# EAGLE schematic DLT_Jetson_Nano (EAGLE 9.4.2)
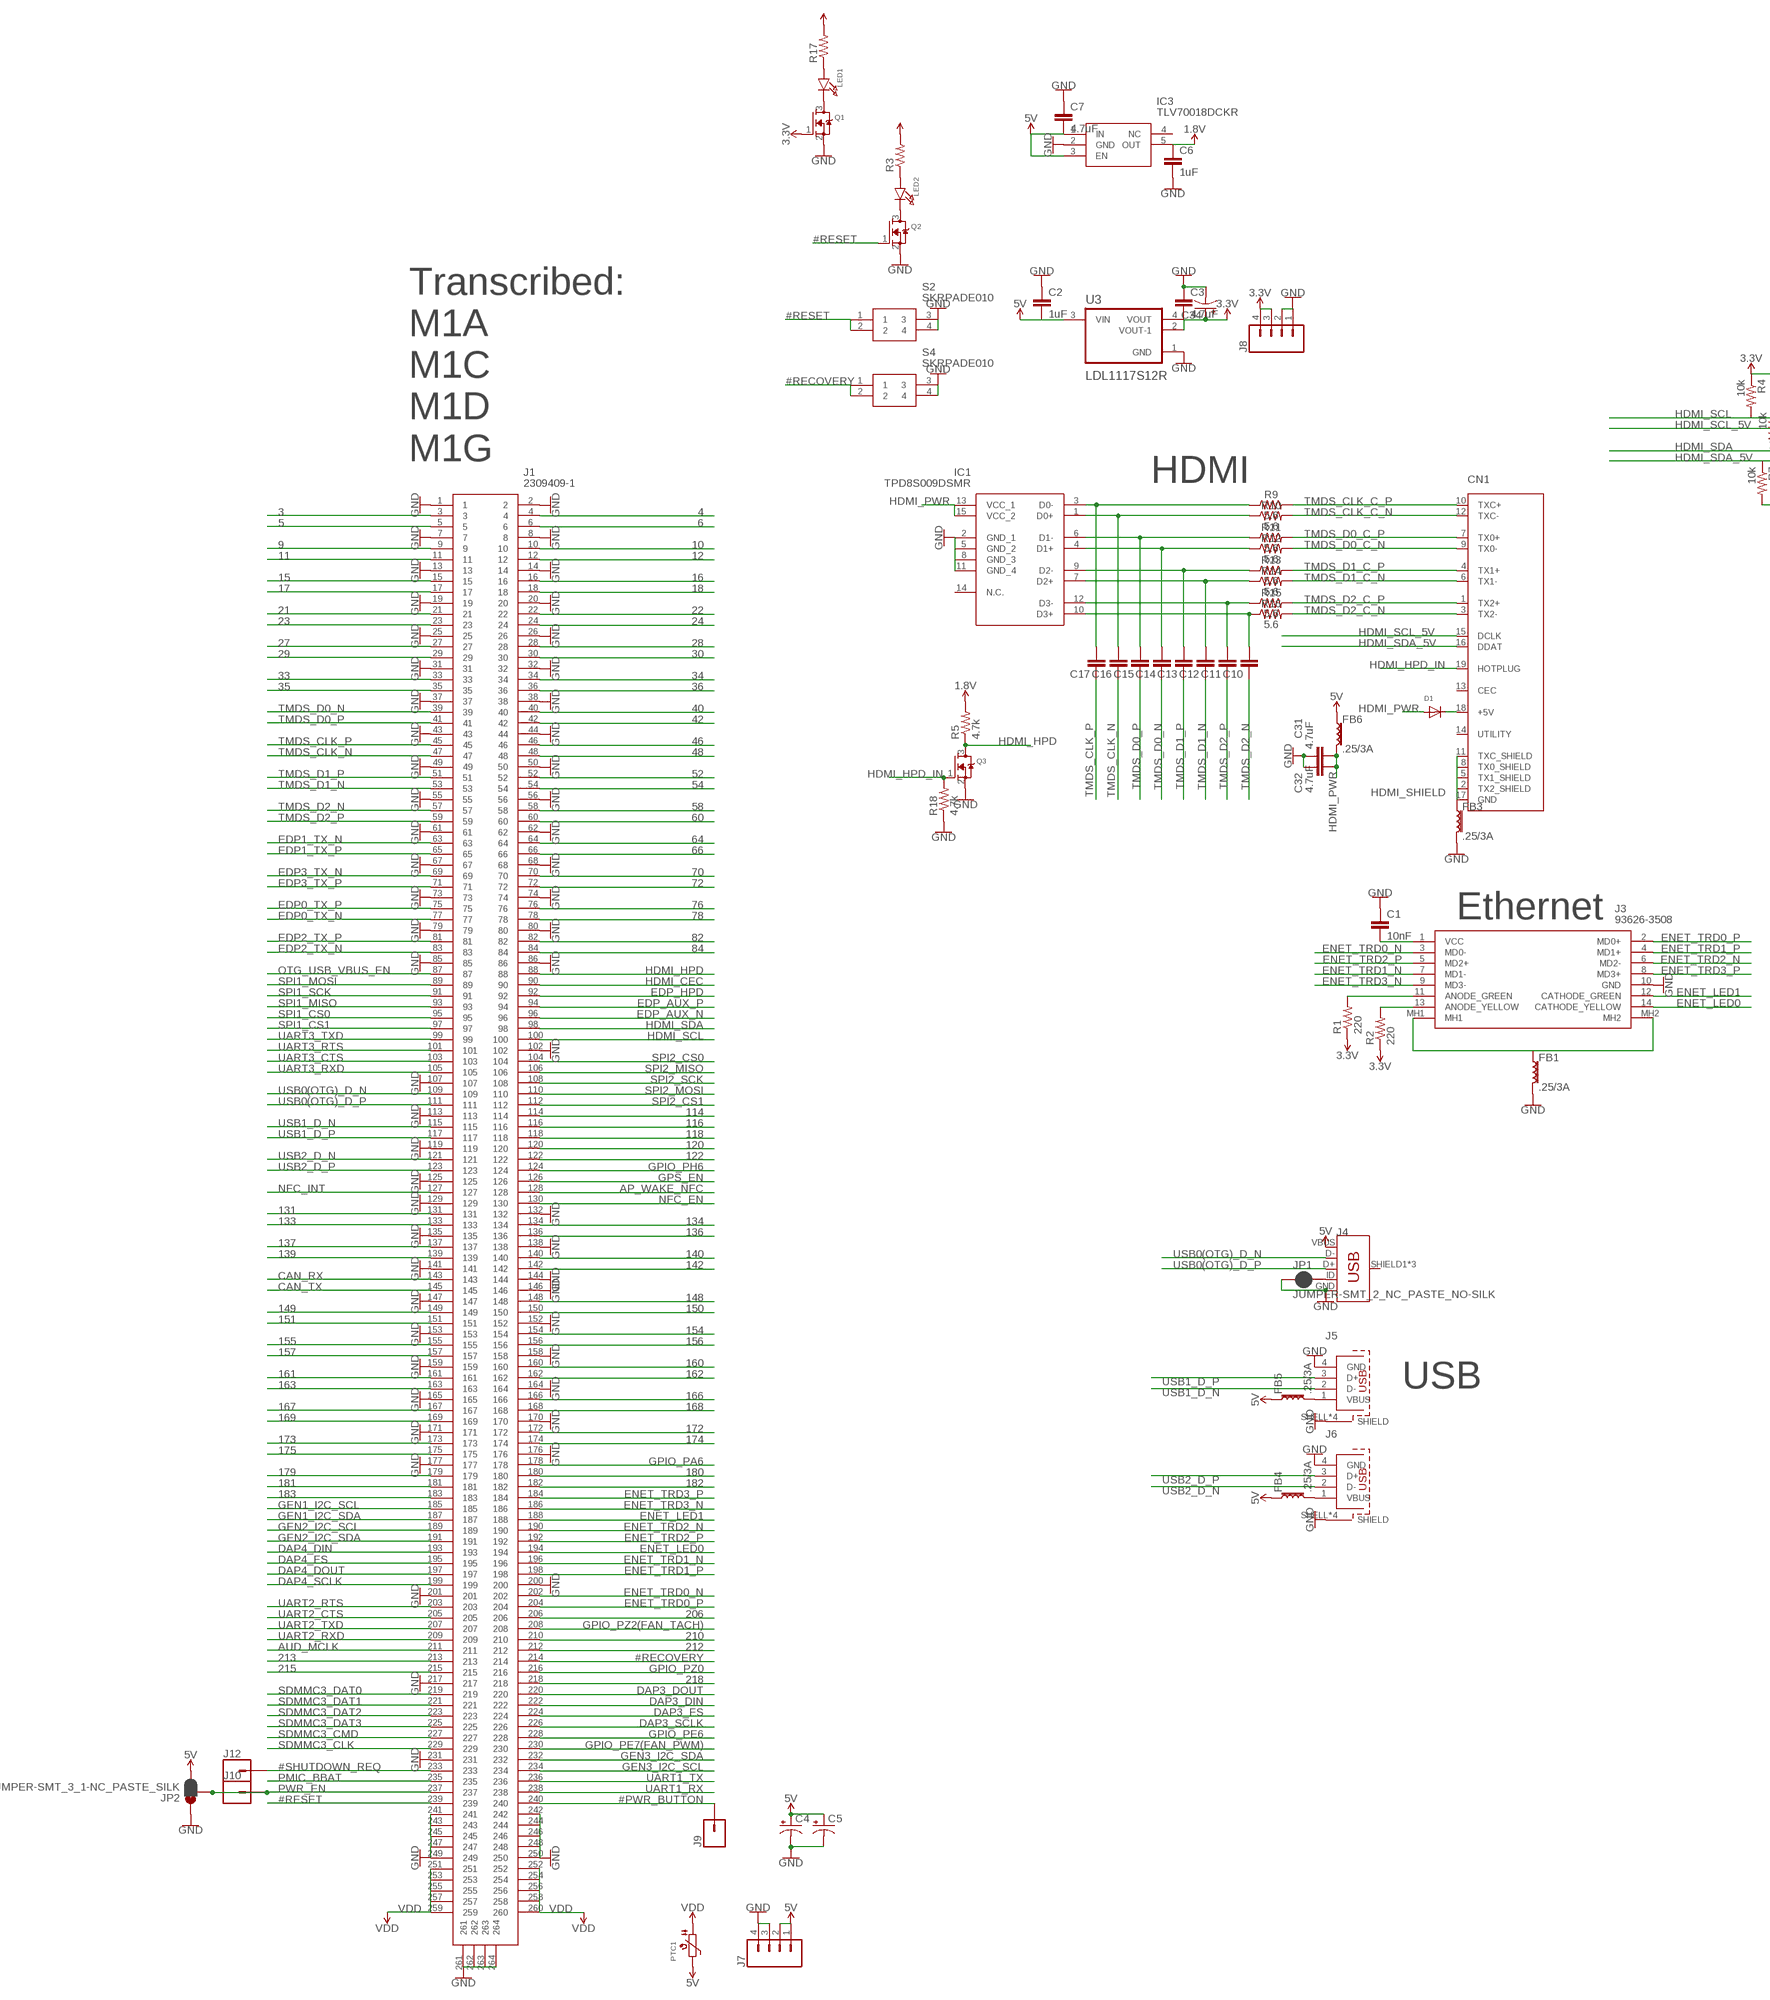
[diagram p0: schematic, sheet 1, part 1 of 2]
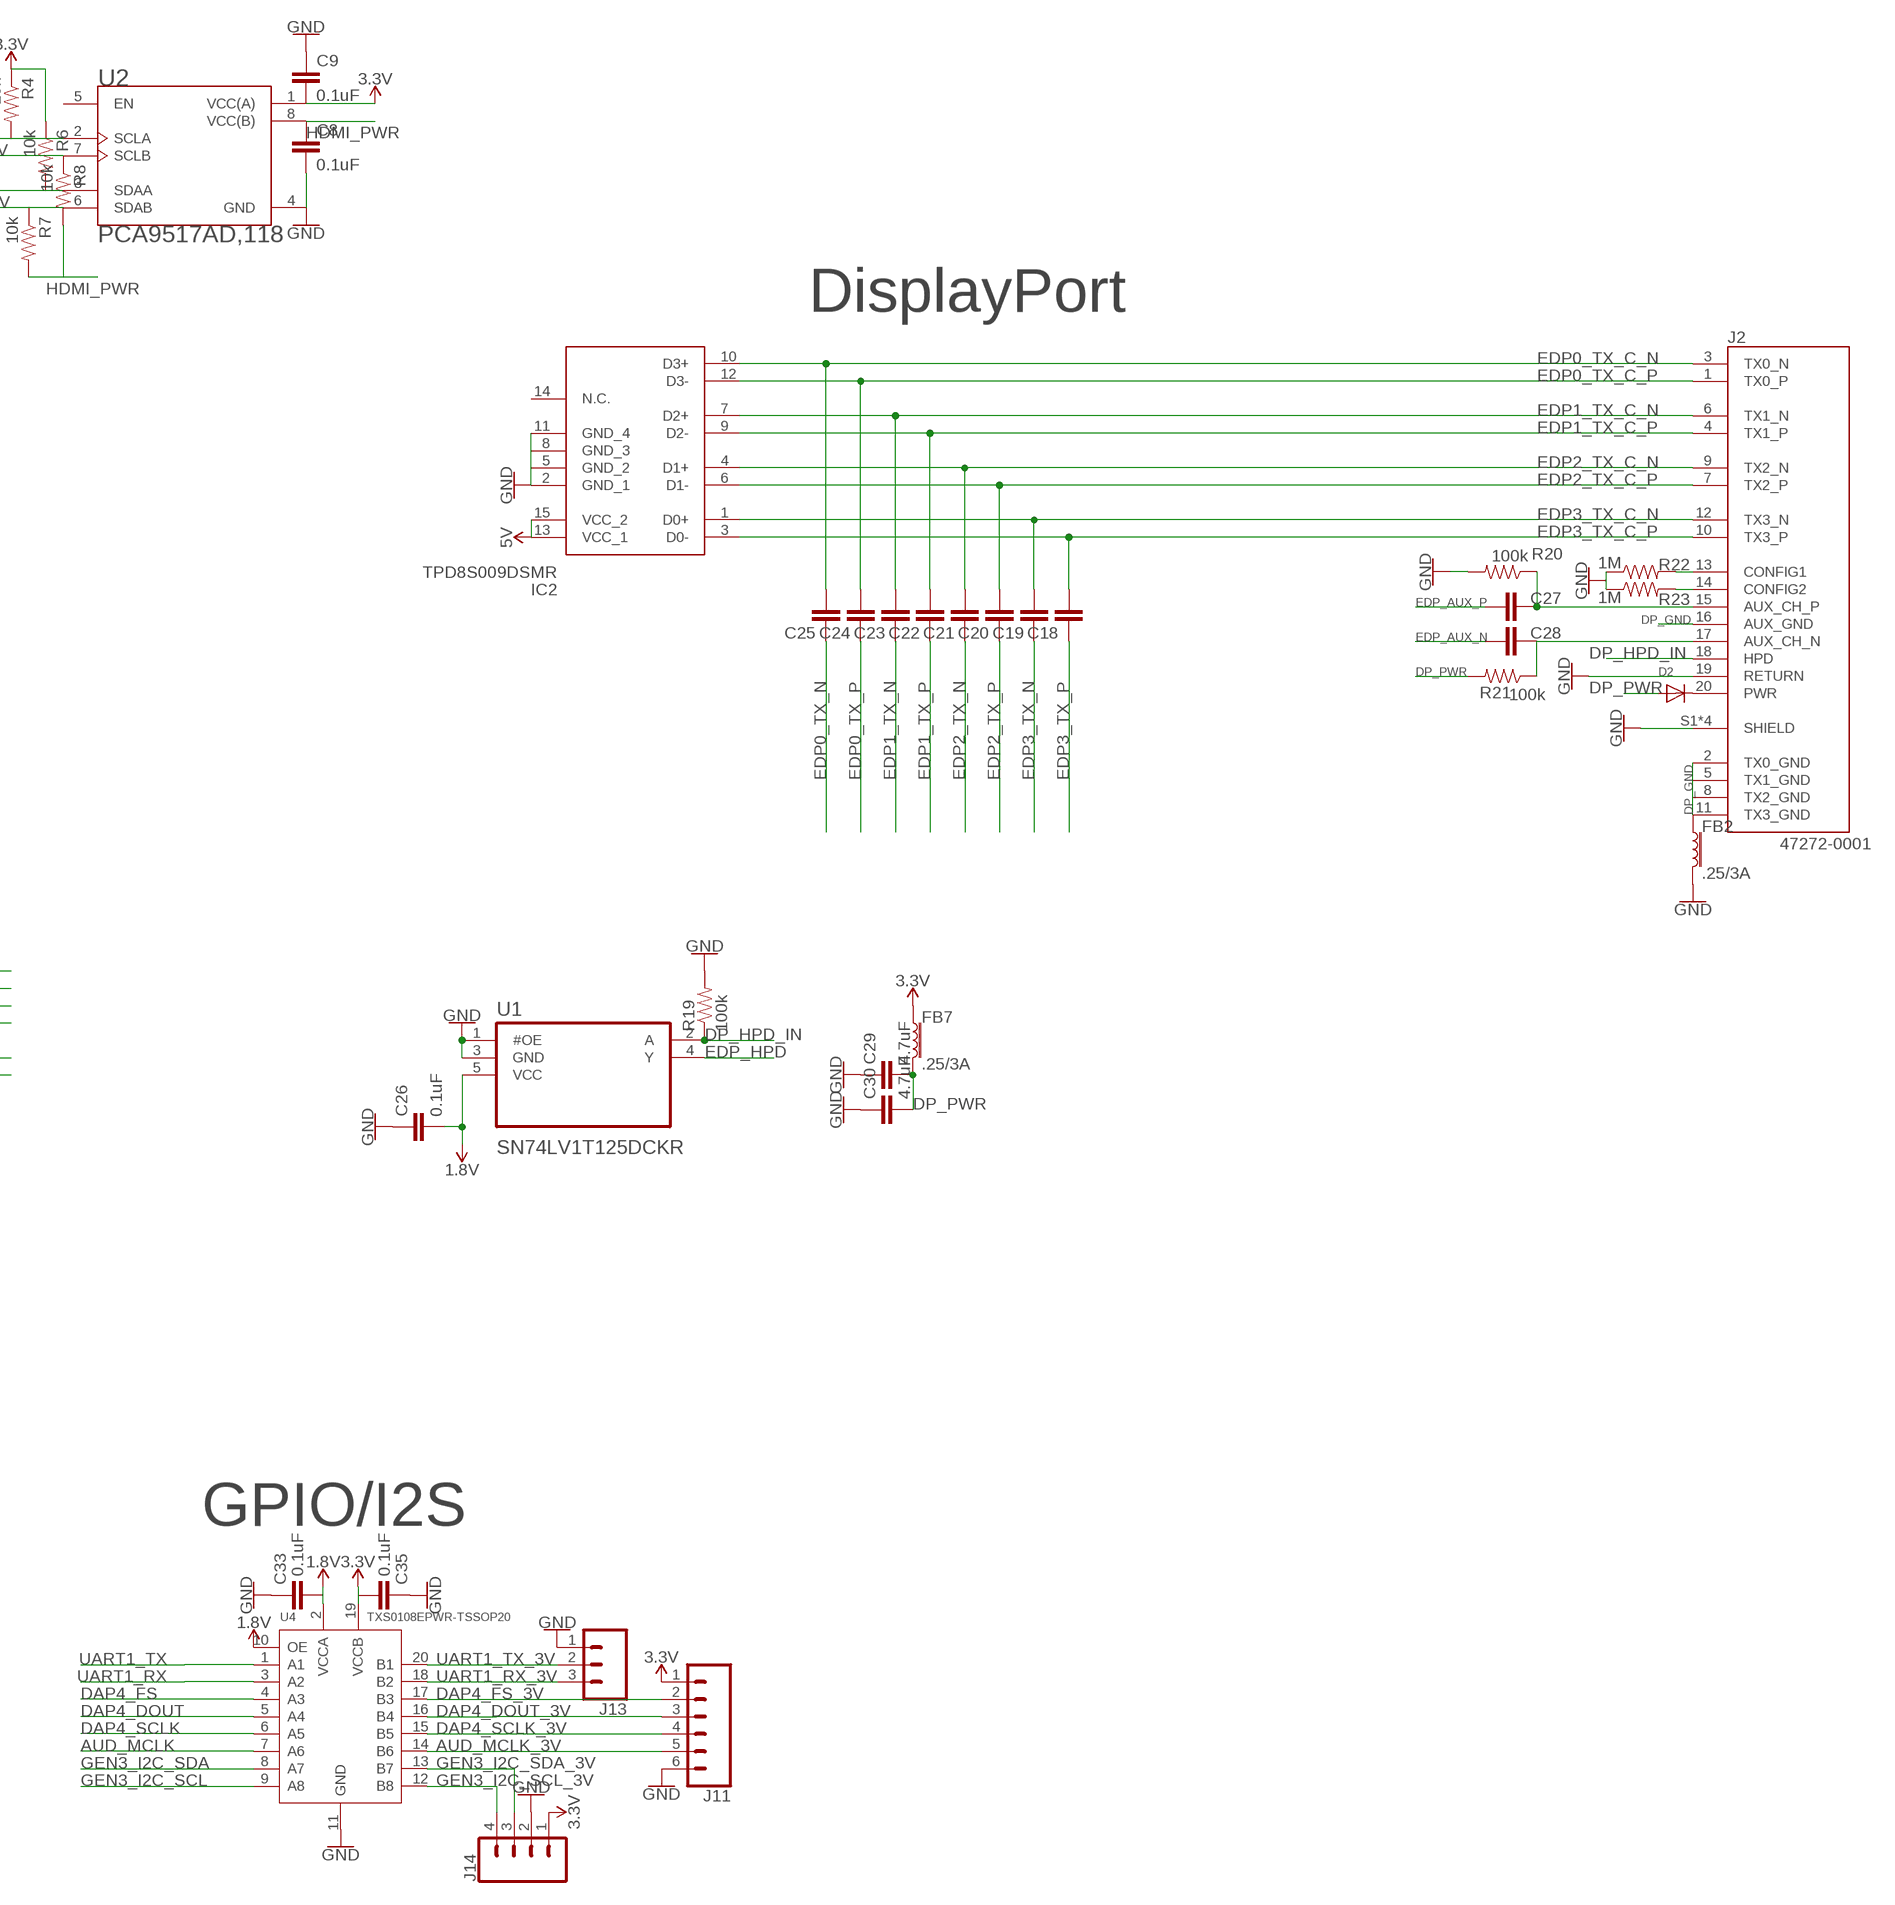
[diagram p1: schematic, sheet 1, part 2 of 2]

## Parts
C1  10nF  10NF-0603-50V-10%  [0603]
C2  1uF  10NF-0603-50V-10%  [0603]
C3  4.7uF  10NF-0603-50V-10%  [0603]
C4  CAP_POLD  [PANASONIC_D]
C5  CAP_POLD  [PANASONIC_D]
C6  1uF  10NF-0603-50V-10%  [0603]
C7  4.7uF  10NF-0603-50V-10%  [0603]
C8  0.1uF  10NF-0603-50V-10%  [0603]
C9  0.1uF  10NF-0603-50V-10%  [0603]
C10  0.1uF  0.1UF-0402-16V-10%  [0402]
C11  0.1uF  0.1UF-0402-16V-10%  [0402]
C12  0.1uF  0.1UF-0402-16V-10%  [0402]
C13  0.1uF  0.1UF-0402-16V-10%  [0402]
C14  0.1uF  0.1UF-0402-16V-10%  [0402]
C15  0.1uF  0.1UF-0402-16V-10%  [0402]
C16  0.1uF  0.1UF-0402-16V-10%  [0402]
C17  0.1uF  0.1UF-0402-16V-10%  [0402]
C18  0.1uF  0.1UF-0402-16V-10%  [0402]
C19  0.1uF  0.1UF-0402-16V-10%  [0402]
C20  0.1uF  0.1UF-0402-16V-10%  [0402]
C21  0.1uF  0.1UF-0402-16V-10%  [0402]
C22  0.1uF  0.1UF-0402-16V-10%  [0402]
C23  0.1uF  0.1UF-0402-16V-10%  [0402]
C24  0.1uF  0.1UF-0402-16V-10%  [0402]
C25  0.1uF  0.1UF-0402-16V-10%  [0402]
C26  0.1uF  10NF-0603-50V-10%  [0603]
C27  0.1uF  0.1UF-0402-16V-10%  [0402]
C28  0.1uF  0.1UF-0402-16V-10%  [0402]
C29  4.7uF  10NF-0603-50V-10%  [0603]
C30  4.7uF  10NF-0603-50V-10%  [0603]
C31  4.7uF  10NF-0603-50V-10%  [0603]
C32  4.7uF  10NF-0603-50V-10%  [0603]
C33  0.1uF  10NF-0603-50V-10%  [0603]
C34  CAP_POLD  [PANASONIC_D]
C35  0.1uF  10NF-0603-50V-10%  [0603]
CN1  HDMI_MOLEX_47151-0001  [HDMI_MOLEX_47151-0001]
D1  DIODESMA  [SMADIODE]
D2  DIODESMA  [SMADIODE]
FB1  .25/3A  FERRITE_BEAD-0603  [0603]
FB2  .25/3A  FERRITE_BEAD-0603  [0603]
FB3  .25/3A  FERRITE_BEAD-0603  [0603]
FB4  .25/3A  FERRITE_BEAD-0603  [0603]
FB5  .25/3A  FERRITE_BEAD-0603  [0603]
FB6  .25/3A  FERRITE_BEAD-0603  [0603]
FB7  .25/3A  FERRITE_BEAD-0603  [0603]
IC1  TPD8S009DSMR  [TPD8S009DSMR]
IC2  TPD8S009DSMR  [TPD8S009DSMR]
IC3  TLV70018DCKR  [SOT65P210X110-5N]
J1  2309409-1  [2309409-1]
J2  47272-0001  [MOLEX_47272-0001]
J3  93626-3508  [936263508]
J4  USB_MICRO-B_FEMALE-SMT  [USB-B-MICRO-SMD]
J5  629104190121  [629104190121]
J6  629104190121  [629104190121]
J7  CONN_04LOCK_LONGPADS  [1X04_LOCK_LONGPADS]
J8  CONN_04LOCK_LONGPADS  [1X04_LOCK_LONGPADS]
J9  CONN_01  [1X01]
J10  CONN_01  [1X01]
J11  CONN_06SILK_FEMALE_PTH  [1X06]
J12  CONN_01  [1X01]
J13  CONN_03  [1X03]
J14  CONN_04  [1X04]
JP1  JUMPER-SMT_2_NC_PASTE_NO-SILK  [SMT-JUMPER_2_NC_PASTE_NO-SILK]
JP2  JUMPER-SMT_3_1-NC_PASTE_SILK  [SMT-JUMPER_3_1-NC_PASTE_SILK]
LED1  LED0805  [CHIPLED_0805]
LED2  LED0805  [CHIPLED_0805]
PTC1  PTC1206  [1206]
Q1  MOSFET-NWAVE  [SOT23-W]
Q2  MOSFET-NWAVE  [SOT23-W]
Q3  MOSFET-NWAVE  [SOT23-W]
R1  220  RESISTOR0805-RES  [0805]
R2  220  RESISTOR0805-RES  [0805]
R3  RESISTOR0805-RES  [0805]
R4  10k  RESISTOR0805-RES  [0805]
R5  4.7k  RESISTOR0805-RES  [0805]
R6  10k  RESISTOR0805-RES  [0805]
R7  10k  RESISTOR0805-RES  [0805]
R8  10k  RESISTOR0805-RES  [0805]
R9  5.6  RESISTOR0402  [0402]
R10  5.6  RESISTOR0402  [0402]
R11  5.6  RESISTOR0402  [0402]
R12  5.6  RESISTOR0402  [0402]
R13  5.6  RESISTOR0402  [0402]
R14  5.6  RESISTOR0402  [0402]
R15  5.6  RESISTOR0402  [0402]
R16  5.6  RESISTOR0402  [0402]
R17  RESISTOR0805-RES  [0805]
R18  4.7k  RESISTOR0805-RES  [0805]
R19  100k  RESISTOR0805-RES  [0805]
R20  100k  RESISTOR0805-RES  [0805]
R21  100k  RESISTOR0805-RES  [0805]
R22  1M  RESISTOR0805-RES  [0805]
R23  1M  RESISTOR0805-RES  [0805]
S2  SKRPADE010  [SKRPADE010]
S4  SKRPADE010  [SKRPADE010]
U1  SN74LV1T125DCKR  [SOT65P210X110-5N]
U2  PCA9517AD,118  [SOIC127P600X175-8N]
U3  LDL1117S12R  [SOT230P700X180-4N]
U4  TXS0108EPWR-TSSOP20  LOGIC-TXS0108EPWR(TSSOP20)  [TSSOP20-0.65-6.5X4.4MM]

## Nets
1.8V: C6.1 C26.2 C33.2 IC3.5(OUT) R5.2 U1.5(VCC) U4.2(VCCA) U4.10(OE)
3: J1.3
3.3V: C3.2 C9.2 C34.+ C35.1 FB7.1 J8.3 J8.4 J11.1 J14.1 Q1.1(G) R1.1 R2.1 R4.1 R6.1 U2.1(VCC(A)) U3.2(VOUT-1) U3.4(VOUT) U4.19(VCCB)
4: J1.4
5: J1.5
5V: C2.2 C4.+ C5.+ C7.2 FB4.1 FB5.1 FB6.1 IC2.13(VCC_1) IC2.15(VCC_2) IC3.1(IN) IC3.3(EN) J4.VBUS J7.1 J7.2 JP2.3 PTC1.2 R3.2 R17.2 U3.3(VIN)
6: J1.6
9: J1.9
10: J1.10
11: J1.11
12: J1.12
15: J1.15
16: J1.16
17: J1.17
18: J1.18
21: J1.21
22: J1.22
23: J1.23
24: J1.24
27: J1.27
28: J1.28
29: J1.29
30: J1.30
33: J1.33
34: J1.34
35: J1.35
36: J1.36
40: J1.40
42: J1.42
46: J1.46
48: J1.48
52: J1.52
54: J1.54
58: J1.58
60: J1.60
64: J1.64
66: J1.66
70: J1.70
72: J1.72
76: J1.76
78: J1.78
82: J1.82
84: J1.84
114: J1.114
116: J1.116
118: J1.118
120: J1.120
122: J1.122
131: J1.131
133: J1.133
134: J1.134
136: J1.136
137: J1.137
139: J1.139
140: J1.140
142: J1.142
148: J1.148
149: J1.149
150: J1.150
151: J1.151
154: J1.154
155: J1.155
156: J1.156
157: J1.157
160: J1.160
161: J1.161
162: J1.162
163: J1.163
166: J1.166
167: J1.167
168: J1.168
169: J1.169
172: J1.172
173: J1.173
174: J1.174
175: J1.175
179: J1.179
180: J1.180
181: J1.181
182: J1.182
183: J1.183
206: J1.206
210: J1.210
212: J1.212
213: J1.213
215: J1.215
218: J1.218
#PWR_BUTTON: J1.240 J9.1
#RECOVERY: J1.214 S4.1 S4.2
#RESET: J1.239 Q2.1(G) S2.1 S2.2
#SHUTDOWN_REQ: J1.233 J12.1
AP_WAKE_NFC: J1.128
AUD_MCLK: J1.211 U4.7(A6)
AUD_MCLK_3V: J11.5 U4.14(B6)
CAN_RX: J1.143
CAN_TX: J1.145
CONFIG1: J2.13(CONFIG1) R22.2
CONFIG2: J2.14(CONFIG2) R23.2
DAP3_DIN: J1.222
DAP3_DOUT: J1.220
DAP3_FS: J1.224
DAP3_SCLK: J1.226
DAP4_DIN: J1.193
DAP4_DOUT: J1.197 U4.5(A4)
DAP4_DOUT_3V: J11.3 U4.16(B4)
DAP4_FS: J1.195 U4.4(A3)
DAP4_FS_3V: J11.2 U4.17(B3)
DAP4_SCLK: J1.199 U4.6(A5)
DAP4_SCLK_3V: J11.4 U4.15(B5)
DP_GND: FB2.1 J2.2(TX0_GND) J2.5(TX1_GND) J2.8(TX2_GND) J2.11(TX3_GND) J2.16(AUX_GND)
DP_HPD_IN: J2.18(HPD) R19.1 U1.2(A)
DP_PWR: C29.2 C30.2 D2.A FB7.2 R21.2
EDP0_TX_C_N: C25.2 IC2.10(D3+) J2.3(TX0_N)
EDP0_TX_C_P: C24.2 IC2.12(D3-) J2.1(TX0_P)
EDP0_TX_N: C25.1 J1.77
EDP0_TX_P: C24.1 J1.75
EDP1_TX_C_N: C23.2 IC2.7(D2+) J2.6(TX1_N)
EDP1_TX_C_P: C22.2 IC2.9(D2-) J2.4(TX1_P)
EDP1_TX_N: C23.1 J1.63
EDP1_TX_P: C22.1 J1.65
EDP2_TX_C_N: C21.2 IC2.4(D1+) J2.9(TX2_N)
EDP2_TX_C_P: C20.2 IC2.6(D1-) J2.7(TX2_P)
EDP2_TX_N: C21.1 J1.83
EDP2_TX_P: C20.1 J1.81
EDP3_TX_C_N: C19.2 IC2.1(D0+) J2.12(TX3_N)
EDP3_TX_C_P: C18.2 IC2.3(D0-) J2.10(TX3_P)
EDP3_TX_N: C19.1 J1.69
EDP3_TX_P: C18.1 J1.71
EDP_AUX_C_N: C28.1 J2.17(AUX_CH_N) R21.1
EDP_AUX_C_P: C27.1 J2.15(AUX_CH_P) R20.1
EDP_AUX_N: C28.2 J1.96
EDP_AUX_P: C27.2 J1.94
EDP_HPD: J1.92 U1.4(Y)
ENET_LED0: J1.194 J3.14(CATHODE_YELLOW)
ENET_LED1: J1.188 J3.12(CATHODE_GREEN)
ENET_TRD0_N: J1.202 J3.3(MD0-)
ENET_TRD0_P: J1.204 J3.2(MD0+)
ENET_TRD1_N: J1.196 J3.7(MD1-)
ENET_TRD1_P: J1.198 J3.4(MD1+)
ENET_TRD2_N: J1.190 J3.6(MD2-)
ENET_TRD2_P: J1.192 J3.5(MD2+)
ENET_TRD3_N: J1.186 J3.9(MD3-)
ENET_TRD3_P: J1.184 J3.8(MD3+)
GEN1_I2C_SCL: J1.185
GEN1_I2C_SDA: J1.187
GEN2_I2C_SCL: J1.189
GEN2_I2C_SDA: J1.191
GEN3_I2C_SCL: J1.234 U4.9(A8)
GEN3_I2C_SCL_3V: J14.4 U4.12(B8)
GEN3_I2C_SDA: J1.232 U4.8(A7)
GEN3_I2C_SDA_3V: J14.3 U4.13(B7)
GND: C1.1 C2.1 C3.1 C4.- C5.- C6.2 C7.1 C8.2 C9.1 C26.1 C29.1 C30.1 C31.1 C32.1 C33.1 C34.- C35.2 FB1.2 FB2.2 FB3.2 IC1.2(GND_1) IC1.5(GND_2) IC1.8(GND_3) IC1.11(GND_4) IC2.2(GND_1) IC2.5(GND_2) IC2.8(GND_3) IC2.11(GND_4) IC3.2(GND) J1.1 J1.2 J1.7 J1.8 J1.13 J1.14 J1.19 J1.20 J1.25 J1.26 J1.31 J1.32 J1.37 J1.38 J1.43 J1.44 J1.49 J1.50 J1.55 J1.56 J1.61 J1.62 J1.67 J1.68 J1.73 J1.74 J1.79 J1.80 J1.85 J1.86 J1.102 J1.107 J1.113 J1.119 J1.125 J1.129 J1.132 J1.135 J1.138 J1.141 J1.144 J1.146 J1.147 J1.152 J1.153 J1.158 J1.159 J1.164 J1.165 J1.170 J1.171 J1.176 J1.177 J1.200 J1.201 J1.217 J1.231 J1.241 J1.242 J1.243 J1.244 J1.245 J1.246 J1.247 J1.248 J1.249 J1.250 J1.261 J1.262 J1.263 J1.264 J2.19(RETURN) J2.S1(SHIELD) J2.S2(SHIELD) J2.S3(SHIELD) J2.S4(SHIELD) J3.10(GND) J4.GND J5.4(GND) J5.SHELL1(SHIELD) J5.SHELL2(SHIELD) J5.SHELL3(SHIELD) J5.SHELL(SHIELD) J6.4(GND) J6.SHELL1(SHIELD) J6.SHELL2(SHIELD) J6.SHELL3(SHIELD) J6.SHELL(SHIELD) J7.3 J7.4 J8.1 J8.2 J11.6 J13.1 J14.2 JP1.1 JP2.1 Q1.2(S) Q2.2(S) Q3.2(S) R18.1 R19.2 R20.2 R22.1 R23.1 S2.3 S2.4 S4.3 S4.4 U1.1(#OE) U1.3(GND) U2.4(GND) U3.1(GND) U4.11(GND)
GPIO_PA6: J1.178
GPIO_PE6: J1.228
GPIO_PE7(FAN_PWM): J1.230
GPIO_PH6: J1.124
GPIO_PZ0: J1.216
GPIO_PZ2(FAN_TACH): J1.208
GPS_EN: J1.126
HDMI_5V_DIODE: CN1.18(+5V) D1.C
HDMI_CEC: J1.90
HDMI_HPD: J1.88 Q3.3(D) R5.1
HDMI_HPD_IN: CN1.19(HOTPLUG) Q3.1(G) R18.2
HDMI_PWR: C8.1 C31.2 C32.2 D1.A FB6.2 IC1.13(VCC_1) IC1.15(VCC_2) R7.2 R8.2 U2.8(VCC(B))
HDMI_SCL: J1.100 R4.2 U2.2(SCLA)
HDMI_SCL_5V: CN1.15(DCLK) R8.1 U2.7(SCLB)
HDMI_SDA: J1.98 R6.2 U2.3(SDAA)
HDMI_SDA_5V: CN1.16(DDAT) R7.1 U2.6(SDAB)
HDMI_SHIELD: CN1.2(TX2_SHIELD) CN1.5(TX1_SHIELD) CN1.8(TX0_SHIELD) CN1.11(TXC_SHIELD) CN1.17(GND) FB3.1
N$1: J3.11(ANODE_GREEN) R1.2
N$2: J3.13(ANODE_YELLOW) R2.2
N$3: C1.2 J3.1(VCC)
N$4: FB1.1 J3.MH1 J3.MH2
N$6: LED2.C Q2.3(D)
N$7: FB5.2 J5.1(VBUS)
N$8: FB4.2 J6.1(VBUS)
N$9: LED2.A R3.1
N$12: J4.ID JP1.2
N$13: LED1.C Q1.3(D)
N$14: LED1.A R17.1
N$20: D2.C J2.20(PWR)
NFC_EN: J1.130
NFC_INT: J1.127
OTG_USB_VBUS_EN: J1.87
PMIC_BBAT: J1.235
PWR_EN: J1.237 J10.1 JP2.2
SDMMC3_CLK: J1.229
SDMMC3_CMD: J1.227
SDMMC3_DAT0: J1.219
SDMMC3_DAT1: J1.221
SDMMC3_DAT2: J1.223
SDMMC3_DAT3: J1.225
SPI1_CS0: J1.95
SPI1_CS1: J1.97
SPI1_MISO: J1.93
SPI1_MOSI: J1.89
SPI1_SCK: J1.91
SPI2_CS0: J1.104
SPI2_CS1: J1.112
SPI2_MISO: J1.106
SPI2_MOSI: J1.110
SPI2_SCK: J1.108
TMDS_CLK_C1_N: C16.2 IC1.1(D0+) R10.1
TMDS_CLK_C1_P: C17.2 IC1.3(D0-) R9.1
TMDS_CLK_C_N: CN1.12(TXC-) R10.2
TMDS_CLK_C_P: CN1.10(TXC+) R9.2
TMDS_CLK_N: C16.1 J1.47
TMDS_CLK_P: C17.1 J1.45
TMDS_D0_C1_N: C14.2 IC1.4(D1+) R12.1
TMDS_D0_C1_P: C15.2 IC1.6(D1-) R11.1
TMDS_D0_C_N: CN1.9(TX0-) R12.2
TMDS_D0_C_P: CN1.7(TX0+) R11.2
TMDS_D0_N: C14.1 J1.39
TMDS_D0_P: C15.1 J1.41
TMDS_D1_C1_N: C12.2 IC1.7(D2+) R14.1
TMDS_D1_C1_P: C13.2 IC1.9(D2-) R13.1
TMDS_D1_C_N: CN1.6(TX1-) R14.2
TMDS_D1_C_P: CN1.4(TX1+) R13.2
TMDS_D1_N: C12.1 J1.53
TMDS_D1_P: C13.1 J1.51
TMDS_D2_C1_N: C10.2 IC1.10(D3+) R16.1
TMDS_D2_C1_P: C11.2 IC1.12(D3-) R15.1
TMDS_D2_C_N: CN1.3(TX2-) R16.2
TMDS_D2_C_P: CN1.1(TX2+) R15.2
TMDS_D2_N: C10.1 J1.57
TMDS_D2_P: C11.1 J1.59
UART1_RX: J1.238 U4.3(A2)
UART1_RX_3V: J13.3 U4.18(B2)
UART1_TX: J1.236 U4.1(A1)
UART1_TX_3V: J13.2 U4.20(B1)
UART2_CTS: J1.205
UART2_RTS: J1.203
UART2_RXD: J1.209
UART2_TXD: J1.207
UART3_CTS: J1.103
UART3_RTS: J1.101
UART3_RXD: J1.105
UART3_TXD: J1.99
USB0(OTG)_D_N: J1.109 J4.D-
USB0(OTG)_D_P: J1.111 J4.D+
USB1_D_N: J1.115 J5.2(D-)
USB1_D_P: J1.117 J5.3(D+)
USB2_D_N: J1.121 J6.2(D-)
USB2_D_P: J1.123 J6.3(D+)
VDD: J1.251 J1.252 J1.253 J1.254 J1.255 J1.256 J1.257 J1.258 J1.259 J1.260 PTC1.1
Unconnected: CN1.13(CEC) CN1.14(UTILITY) IC1.14(N.C.) IC2.14(N.C.) IC3.4(NC) J4.SHIELD1(SHIELD) J4.SHIELD2(SHIELD) J4.SHIELD3(SHIELD) U2.5(EN)

## Notes on the sheet
- Transcribed:
  M1A
  M1C
  M1D
  M1G
- HDMI
- DisplayPort
- Ethernet
- GPIO/I2S
- USB

## Power pins joined to a net without a drawn wire
GND: CN1.P$1(GND) CN1.P$2(GND) CN1.P$3(GND) CN1.P$4(GND)

## Library data of the parts
C1 = SparkFun-Capacitors:10NF: 0.01uF/10nF/10,000pF ceramic capacitors A capacitor is a passive two-terminal electrical component used to store electrical energy temporarily in an electric field. CAP-09321; PROD_ID: CAP-00867
C2 C3 C6-C9 C26 C29-C33 C35 = SparkFun-Capacitors:10NF: 0.01uF/10nF/10,000pF ceramic capacitors A capacitor is a passive two-terminal electrical component used to store electrical energy temporarily in an electric field. CAP-09321; PROD_ID: CAP-00867; VALUE: 10nF
C4 C5 C34 = SparkFun-Passives:CAP_POL: Capacitor Polarized These are standard SMD and PTH capacitors. Normally 10uF, 47uF, and 100uF in electrolytic and tantalum varieties. Always verify the external diameter of the through hole cap, it varies with capacity, voltage, and manufacturer. The EIA devices should be standard.
C10-C25 C27 C28 = SparkFun-Capacitors:0.1UF: 0.1µF ceramic capacitors A capacitor is a passive two-terminal electrical component used to store electrical energy temporarily in an electric field.; PROD_ID: CAP-12416
CN1 = microbuilder:HDMI_MOLEX_47151-0001
D1 D2 = microbuilder:DIODE: Diode SMA Model Volts Amps Type Vf Vr Digikey # Notes SSA34-E3 40V 3A Schottky 480mV @ 3A 200uA @ 40V SSA34-E3/61TGITR-ND CDBA120-G 20V 1A Schottky 500mV @ 1A 500uA @ 20V 641-1014-6-ND REEL MBRA210 10V 2A Schottky 350mV @ 2A 700uA @ 10V MBRA210LT3 SOD-123 Model Volts Amps Type Vf Vr Order # Notes BAT54T1G 30V 200mA Schottky 800mV @ 200mA 2uA @ 25V BAT54T1GOSTR-ND B0530W 30V 500mA Schottky 430mV @ 500mA 130uA @ 30V B0530W-FDICT-ND REEL MBR120 1A 20V Schottky 340mV @ 1A MBR120VLSFT1GOSCT-ND SOD-323 Model Volts Amps Type Vf Vr Order # Notes PMEG2005EJ 20V 500mA Schottky 355mV @ 500mA 568-4110-1-ND ZLLS410 10V 570mA Schottky 380mV @ 570mA ZLLS410CT-ND 1N4148WS 75V 150mA Silicon/Simple 1V 1N4148WSFSCT-ND REEL SOD-523 Model Volts Amps Type Vf Vr Order # Notes BAT54XV2 30V 200mA Schottky 0.8V @ 100mA BAT54XV2CT-ND TB751S 30V 30mA Schottky RB751S-40TE61CT-ND SOT23-R/W (R = Solder Paste/Reflow Ovens, W = Hand-Soldering) Model Volts Amps Type Vf Vr Order # Notes BAT54FILM 40V 300mA Schottky 497-7162-1-ND
FB1-FB7 = SparkFun-Coils:FERRITE_BEAD: Ferrite Bead (blocks, cores, rings, chokes, etc.) Inductor with layers of ferrite used to suppress high frequencies. Often used to isolate high frequency noise. SparkFun Products: IOIO-OTG - V2.2 <https://www.sparkfun.com/products/13613> SparkFun SAMD21 Mini Breakout <https://www.sparkfun.com/products/13664> SparkFun 6 Degrees of Freedom Breakout - LSM6DS3 <https://www.sparkfun.com/products/13339> SparkFun SAMD21 Dev Breakout <https://www.sparkfun.com/products/13672>; PROD_ID: NDUC-13805; VALUE: 30Ω/1.8A
IC1 IC2 = SamacSys_Parts:TPD8S009DSMR: 8-Channel ESD Solution for HDMI/DisplayPort Source: Datasheet <http://www.ti.com/lit/ds/symlink/tpd8s009.pdf>; DESCRIPTION: 8-Channel ESD Solution for HDMI/DisplayPort; HEIGHT: 0mm; MANUFACTURER_NAME: Texas Instruments; MANUFACTURER_PART_NUMBER: TPD8S009DSMR; MOUSER_PART_NUMBER: 595-TPD8S009DSMR; MOUSER_PRICE-STOCK: https://www.mouser.com/Search/Refine.aspx?Keyword=595-TPD8S009DSMR
IC3 = SamacSys_Parts:TLV70018DCKR: 200-mA, Low-IQ, Low-Dropout Regulator for Portable Devices Source: Datasheet <http://www.ti.com/lit/gpn/tlv700>; DESCRIPTION: 200-mA, Low-IQ, Low-Dropout Regulator for Portable Devices; HEIGHT: mm; MANUFACTURER_NAME: Texas Instruments; MANUFACTURER_PART_NUMBER: TLV70018DCKR; MOUSER_PART_NUMBER: 595-TLV70018DCKR; MOUSER_PRICE-STOCK: https://www.mouser.com/Search/Refine.aspx?Keyword=595-TLV70018DCKR
J1 = SamacSys_Parts:2309409-1: TE CONNECTIVITY - 2309409-1 - CONN, DDR4 SODIMM SOCKET, 260POS, 0.5MM Source: Datasheet <https://componentsearchengine.com/Datasheets/1/2309409-1.pdf>; DESCRIPTION: TE CONNECTIVITY - 2309409-1 - CONN, DDR4 SODIMM SOCKET, 260POS, 0.5MM; HEIGHT: mm; MANUFACTURER_NAME: TE Connectivity; MANUFACTURER_PART_NUMBER: 2309409-1; MOUSER_PART_NUMBER: 571-2309409-1; MOUSER_PRICE-STOCK: https://www.mouser.com/Search/Refine.aspx?Keyword=571-2309409-1
J2 = 47272-0001:47272-0001: Conn Display Port RCP 20 POS 0.5mm Solder RA SMD 20 Terminal 1 Port DisplayPort T/R; AVAILABILITY: Unavailable; DESCRIPTION: Conn Display Port RCP 20 POS 0.5mm Solder RA SMD 20 Terminal 1 Port DisplayPort T/R; MF: Molex; MP: 47272-0001; PACKAGE: None; PRICE: None
J3 = SamacSys_Parts:93626-3508: MOLEX - 93626-3508 - RJ45 CONNECTOR, JACK, 8P8C, 1PORT, TH Source: Datasheet <https://componentsearchengine.com/Datasheets/1/93626-3508.pdf>; DESCRIPTION: MOLEX - 93626-3508 - RJ45 CONNECTOR, JACK, 8P8C, 1PORT, TH; HEIGHT: 15.4mm; MANUFACTURER_NAME: Molex; MANUFACTURER_PART_NUMBER: 93626-3508; MOUSER_PART_NUMBER: 538-93626-3508; MOUSER_PRICE-STOCK: https://www.mouser.com/Search/Refine.aspx?Keyword=538-93626-3508
J4 = SparkFun-Connectors:USB_MICRO-B: USB Type Micro-B Connector Male/female and PTH/SMT variants SparkFun Products: SparkFun microB USB Breakout <https://www.sparkfun.com/products/12035> SparkFun USB microB Plug Breakout <https://www.sparkfun.com/products/10031> SparkFun ESP8266 Thing <https://www.sparkfun.com/products/13231>; PROD_ID: CONN-11752
J5 J6 = EAGLE-INPUT_OUTPUT_CONNECTORS-rev17a:629104190121: USB 2.0 Type A Horizontal SMT Short Type WR-COM_629104190121 <http://katalog.we-online.de/media/images/v2/Family_WR-COM_629104190121.jpg> Details see: http://katalog.we-online.de/en/em/COM_2_0_SMT_TYPE_A_HORIZONTAL_SHORT_TYPE/629104190121 Created bY Yingchun,Shan 2016 (C) Würth Elektronik
J7 J8 J14 = SparkFun-Connectors:CONN_04: Multi connection point. Often used as Generic Header-pin footprint for 0.1 inch spaced/style header connections On any of the 0.1 inch spaced packages, you can populate with these: Break Away Headers - Straight <https://www.sparkfun.com/products/116> (PRT-00116) Break Away Male Headers - Right Angle <https://www.sparkfun.com/products/553> (PRT-00553) Female Headers <https://www.sparkfun.com/products/115> (PRT-00115) Break Away Headers - Machine Pin <https://www.sparkfun.com/products/117> (PRT-00117) Break Away Female Headers - Swiss Machine Pin <https://www.sparkfun.com/products/743> (PRT-00743) For SCREWTERMINALS and SPRING TERMINALS visit here: Screw Terimnals on SparkFun.com <https://www.sparkfun.com/search/results?term=Screw+Terminals> (5mm/3.5mm/2.54mm spacing) This device is also useful as a general connection point to wire up your design to another part of your project. Our various solder wires solder well into these plated through hole pads. Hook-Up Wire - Assortment (Stranded, 22 AWG) <https://www.sparkfun.com/products/11375> (PRT-11375) Hook-Up Wire - Assortment (Solid Core, 22 AWG) <https://www.sparkfun.com/products/11367> (PRT-11367) View the entire wire category on our website here <https://www.sparkfun.com/categories/141> Special notes: Molex polarized connector foot print use with SKU : PRT-08231 with associated crimp pins and housings. 1MM SMD Version SKU: PRT-10208; PROD_ID: CONN-09696
J9 J10 J12 = SparkFun-Connectors:CONN_01: Single connection point. Often used as Generic Header-pin footprint for 0.1 inch spaced/style header connections On any of the 0.1 inch spaced packages, you can populate with these: Break Away Headers - Straight <https://www.sparkfun.com/products/116> (PRT-00116) Break Away Male Headers - Right Angle <https://www.sparkfun.com/products/553> (PRT-00553) Female Headers <https://www.sparkfun.com/products/115> (PRT-00115) Break Away Headers - Machine Pin <https://www.sparkfun.com/products/117> (PRT-00117) Break Away Female Headers - Swiss Machine Pin <https://www.sparkfun.com/products/743> (PRT-00743) This device is also useful as a general connection point to wire up your design to another part of your project. Our various solder wires solder well into these plated through hole pads. Hook-Up Wire - Assortment (Stranded, 22 AWG) <https://www.sparkfun.com/products/11375> (PRT-11375) Hook-Up Wire - Assortment (Solid Core, 22 AWG) <https://www.sparkfun.com/products/11367> (PRT-11367) View the entire wire category on our website here <https://www.sparkfun.com/categories/141> Special notes: SMTSO-256-ET is a "flush mount" nut for a 4-40 screw. We mostly use this on specialty testbeds; it is a nice way to connect hardware to your PCB at an adjustable hieght. Also note, the SNAP packages are for using a snappable style connector. We sell a baggie of snaps and they are also used on two LilyPad designs: Snap Assortment - 30 pack (male and female) <https://www.sparkfun.com/products/11347> (DEV-11347) LilyPad Arduino SimpleSnap <https://www.sparkfun.com/products/10941> (DEV-10941) LilyPad SimpleSnap Protoboard <https://www.sparkfun.com/products/10940> (DEV-10940)
J11 = SparkFun-Connectors:CONN_06: Multi connection point. Often used as Generic Header-pin footprint for 0.1 inch spaced/style header connections On any of the 0.1 inch spaced packages, you can populate with these: Break Away Headers - Straight <https://www.sparkfun.com/products/116> (PRT-00116) Break Away Male Headers - Right Angle <https://www.sparkfun.com/products/553> (PRT-00553) Female Headers <https://www.sparkfun.com/products/115> (PRT-00115) Break Away Headers - Machine Pin <https://www.sparkfun.com/products/117> (PRT-00117) Break Away Female Headers - Swiss Machine Pin <https://www.sparkfun.com/products/743> (PRT-00743) Arduino Stackable Header - 6 Pin <https://www.sparkfun.com/products/9280> (PRT-09280) For SCREWTERMINALS and SPRING TERMINALS visit here: Screw Terimnals on SparkFun.com <https://www.sparkfun.com/search/results?term=Screw+Terminals> (5mm/3.5mm/2.54mm spacing) This device is also useful as a general connection point to wire up your design to another part of your project. Our various solder wires solder well into these plated through hole pads. Hook-Up Wire - Assortment (Stranded, 22 AWG) <https://www.sparkfun.com/products/11375> (PRT-11375) Hook-Up Wire - Assortment (Solid Core, 22 AWG) <https://www.sparkfun.com/products/11367> (PRT-11367) View the entire wire category on our website here <https://www.sparkfun.com/categories/141>; PROD_ID: CONN-08437
J13 = SparkFun-Connectors:CONN_03: Multi connection point. Often used as Generic Header-pin footprint for 0.1 inch spaced/style header connections On any of the 0.1 inch spaced packages, you can populate with these: Break Away Headers - Straight <https://www.sparkfun.com/products/116> (PRT-00116) Break Away Male Headers - Right Angle <https://www.sparkfun.com/products/553> (PRT-00553) Female Headers <https://www.sparkfun.com/products/115> (PRT-00115) Break Away Headers - Machine Pin <https://www.sparkfun.com/products/117> (PRT-00117) Break Away Female Headers - Swiss Machine Pin <https://www.sparkfun.com/products/743> (PRT-00743) Stackable Header - 3 Pin (Female, 0.1") <https://www.sparkfun.com/products/13875> (PRT-13875) For SCREWTERMINALS and SPRING TERMINALS visit here: Screw Terimnals on SparkFun.com <https://www.sparkfun.com/search/results?term=Screw+Terminals> (5mm/3.5mm/2.54mm spacing) This device is also useful as a general connection point to wire up your design to another part of your project. Our various solder wires solder well into these plated through hole pads. Hook-Up Wire - Assortment (Stranded, 22 AWG) <https://www.sparkfun.com/products/11375> (PRT-11375) Hook-Up Wire - Assortment (Solid Core, 22 AWG) <https://www.sparkfun.com/products/11367> (PRT-11367) View the entire wire category on our website here <https://www.sparkfun.com/categories/141> Special notes: Molex polarized connector foot print use with SKU : PRT-08232 with associated crimp pins and housings.
JP1 = SparkFun-Jumpers:JUMPER-SMT_2_NC_PASTE: Normally closed solder jumper This jumper has an aperture in the stencil to allow solder paste to bridge the split in the wire so it's normally closed (NC). Wick off the solder to open the connection. Reapply solder to reclose the connection.
JP2 = SparkFun-Jumpers:JUMPER-SMT_3_1-NC_PASTE: Normally closed solder jumper (1 of 2 connections) This jumper has an aperture in the stencil to allow solder paste to bridge one of the two connections. One connection is normally closed (NC), while the other is normally open (NO). Wick off the solder to open the connection. Reapply solder to reclose the connection. Apply solder to the other side instead to change the current path.
LED1 LED2 = microbuilder:LED: LED 0603 - 0603 Surface Mount Package 2mA: Green LED - Low Power (3.9mcd, 2ma, 1.7Vf) - Digikey: 475-2709-2-ND Orange LED - Low Power (9.8mcd, 2ma, 1.8Vf) - Digikey: 475-1194-2-ND Red LED - Low Power (5mcd, 2ma, 1.8Vf) - Digikey: 475-1195-2-ND Yellow LED - Low Power (7mcd, 2ma, 1.8Vf) - Digikey: 475-1196-2-ND 5mA: Blue LED - Low Power (17mcd, 5ma, 2.9Vf) - Digikey: LNJ937W8CRACT-ND 0805 - 0805 Surface Mount Package 2mA: Red LED (8.8mcd, 2mA, 1.8Vf, Clear) - Low Power [Digikey: 475-2510-1-ND] Green LED (5mcd, 2mA, 1.8Vf, Clear) - Low Power [Digikey: 475-2730-1-ND] Yellow LED (11.3mcd, 2mA, 1.8Vf, Clear) - Low Power [Digikey: 475-2555-1-ND] 20mA: Red LED (104mcd, 20mA, Diffused) - LS R976 [Digikey: 475-1278-6-ND] Red LED (12mcd, 20mA, 2.0Vf, Clear) - APT2012EC [Digikey: 754-1128-1-ND] Green LED (15mcd, 20mA, 2.2Vf, Clear) - APT2012GC [Digikey: 754-1131-1-ND] Orange LED (160mcd, 20mA, 2.1Vf, Clear) - APT2012SECK [Digikey: 754-1130-1-ND] 1206 - 1206 Surface Mount Package Green LED (26mcd, 20mA, Diffused) - LG N971 [Digikey: 475-1407-6-ND] Red LED (15mcd, 20mA, Diffused) - LH N974 [Digikey: 475-1416-6-ND]
PTC1 = microbuilder:PTC: PTC (Resettable Fuse) 1206 Package 250mA PTC (16V Max, Time-to-Trip: 0.08s) - Digikey: F2110CT-ND 1210 Package 100mA PTC (30V Max, Time-to-Trip: 0.6s) - Digikey: MF-USMF010-2CT-ND 1812 Package 750mA PTC (24V Max, Time-to-Trip: 0.2s) - Digikey: MF-MSMF075/24-2CT-ND
Q1-Q3 = microbuilder:MOSFET-N: N-Channel Mosfet LEGEND VDS: Voltage Drain-Source ID: Drain Current RDS(ON): Drain-Source On-State Resistance VGS(TH): Gate-Source Threshold Voltage CISS: Drain-Source Input Capacitance SOT-23 Name VDS ID RDS(ON) VGS(TH) CISS Order Number 2N7002E 60V 260mA 2.5 Ohm 2.5V @ 250uA 26.7pF @ 25V 2N7002ET1GOSTR-ND BSH103 30V 850mA 400 mOhm 400mV @ 1mA 83pF @ 24V BSH103,235-ND BSS138 60V 320mA 1.6 Ohm 1.5V @ 250uA 50pF @ 10V Mouser: 771-BSS138PW115 DMN2075U-7 20V 4.2A 38 mOhm 1V @ 250 uA 594.3pF @ 10V DMN2075U-7DICT-ND * BSS138 good choice for I2C level-shifting
R1-R8 R17-R23 = SparkFun-Passives:RESISTOR: Resistor Basic schematic elements and footprints for 0603, 1206, and PTH resistors.
R9-R16 = SparkFun-Resistors:RESISTOR: Generic Resistor Package
S2 S4 = SamacSys_Parts:SKRPADE010: Tactile Switches 4.2x3.2x2.5mm 408gf Source: Datasheet <https://componentsearchengine.com/Datasheets/1/SKRPADE010.pdf>; DESCRIPTION: Tactile Switches 4.2x3.2x2.5mm 408gf; HEIGHT: 2mm; MANUFACTURER_NAME: ALPS; MANUFACTURER_PART_NUMBER: SKRPADE010; MOUSER_PART_NUMBER: 688-SKRPAD; MOUSER_PRICE-STOCK: https://www.mouser.com/Search/Refine.aspx?Keyword=688-SKRPAD
U1 = SN74LV1T125DCKR:SN74LV1T125DCKR: None; AVAILABILITY: Unavailable; DESCRIPTION: Single Power Supply, Single BUFFER GATE w/ 3-State Output _active low enable_ 5-SC70 -40 to 125; MF: Texas Instruments; MP: SN74LV1T125DCKR; PACKAGE: SC-70-5 Texas Instruments; PRICE: None
U2 = PCA9517AD_118:PCA9517AD,118: PCA9517A Series 2.7 V to 5.5 V Level Translating I2C-Bus Repeater - SOIC - 8; AVAILABILITY: Unavailable; DESCRIPTION: PCA9517A Series 2.7 V to 5.5 V Level Translating I2C-Bus Repeater - SOIC - 8; MF: NXP USA; MP: PCA9517AD,118; PACKAGE: SO-8 NXP Semiconductors; PRICE: None
U3 = LDL1117S12R:LDL1117S12R: None; AVAILABILITY: Good; DESCRIPTION: 1.2 A High PSRR low dropout linear voltage regulator; MF: STMicroelectronics; MP: LDL1117S12R; PACKAGE: SOT-223 STMicroelectronics; PRICE: 0.22 USD
U4 = OPL_IC:LOGIC-TXS0108EPWR(TSSOP20): 310050026; MPN: TXS0108EPWR